# Altium project ESP01-S-UART.PrjPcb
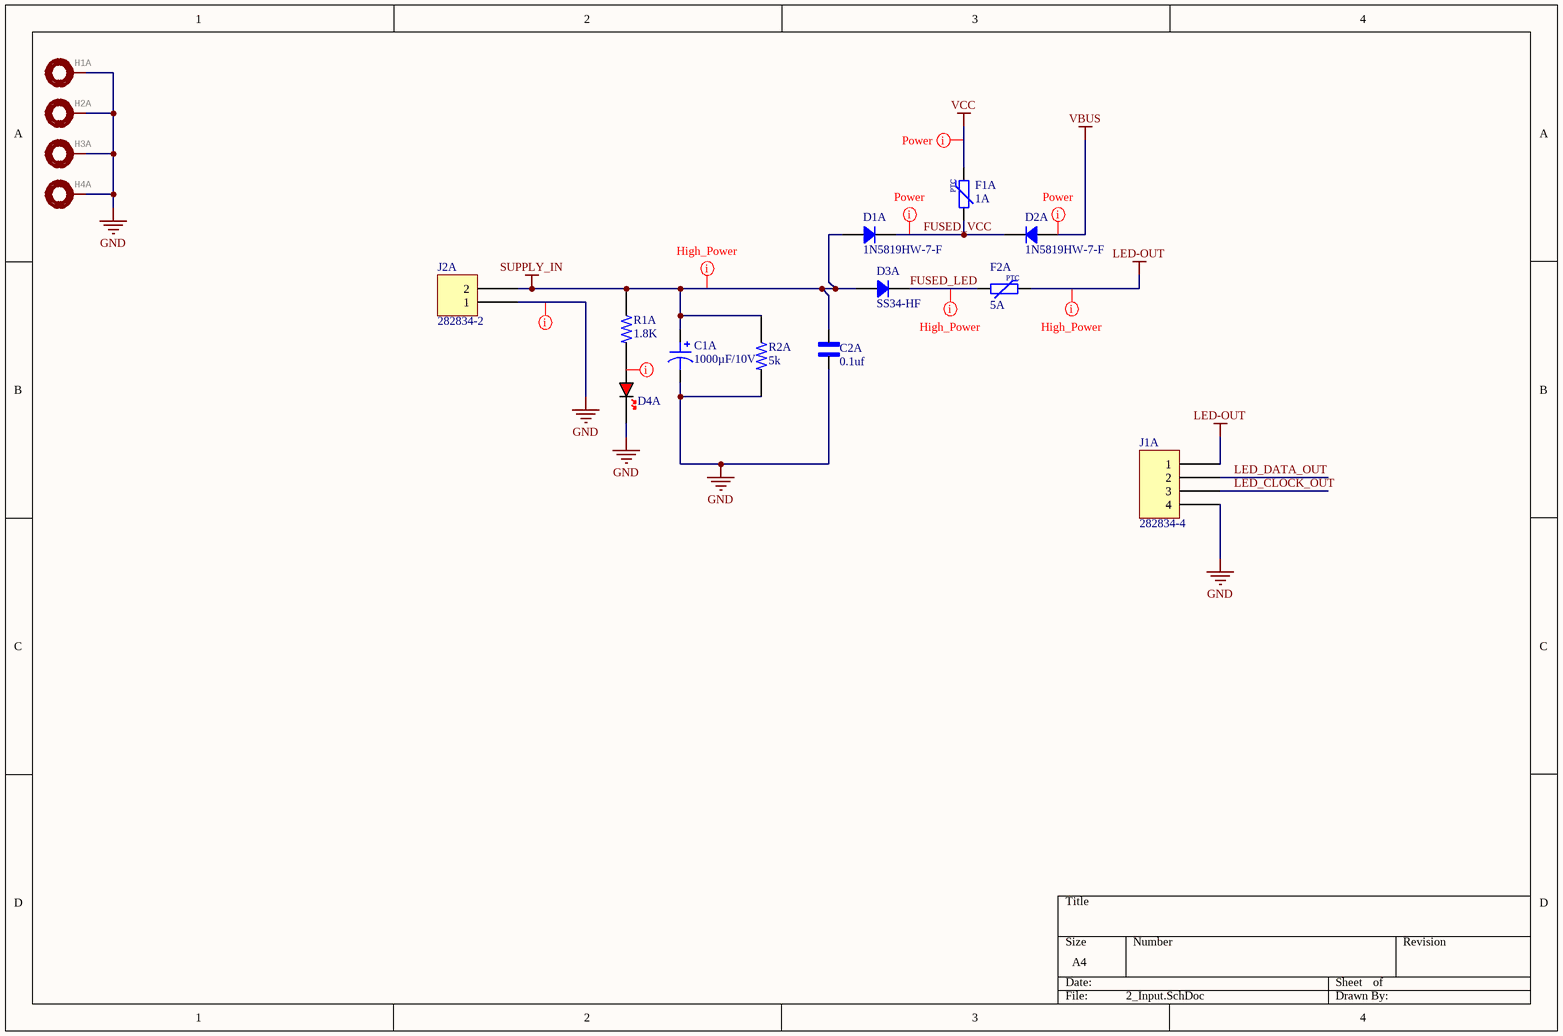
[diagram p0: 2_Input.SchDoc]
5 sheets, 62 parts. Net scope: global (net labels, ports and power ports of the same name join across sheets).
Board file: ESP01-S-UART_Version_1.PcbDoc
Sheets:
  1_Overview.SchDoc
  2_Input.SchDoc
  3_LDO.SchDoc
  4_USB.SchDoc
  5_ESP_01.SchDoc

## Sheet 1_Overview.SchDoc
size A4; SheetNumber: 5; SheetTotal: 5

## Sheet 2_Input.SchDoc
size A4; SheetNumber: 2; SheetTotal: 5

### Parts
C1A  1000µF/10V  [CAP TH ALUM ELEC D8.00mm S3.50mm H13.00mm]
C2A  0.1uf  [C-0603]
D1A  1N5819HW-7-F  [SOD-123]
D2A  1N5819HW-7-F  [SOD-123]
D3A  SS34-HF  [DO214AC SMA]
D4A  RED  [LED_0603_RED]  (value not drawn)
F1A  1A  [FUSE_1206]
F2A  5A  [FUSE_1206]
H1A  MOUNTING PAD, round  [2,8-PAD]  (value not drawn)
H2A  MOUNTING PAD, round  [2,8-PAD]  (value not drawn)
H3A  MOUNTING PAD, round  [2,8-PAD]  (value not drawn)
H4A  MOUNTING PAD, round  [2,8-PAD]  (value not drawn)
J1A  282834-4  [TE 282834-4]
J2A  282834-2  [TE 282834-2]
R1A  1.8K  [R-0603]
R2A  5k  [R-0603]

### Nets
GND: C1A.2 C2A.1 D4A.K H1A.1(MOUNT) H2A.1(MOUNT) H3A.1(MOUNT) H4A.1(MOUNT) J1A.4 J2A.1 R2A.2
LED-OUT: F2A.2 J1A.1
SUPPLY_IN: C1A.1 C2A.2 D1A.1 D3A.1 J2A.2 R1A.1 R2A.1
VBUS: D2A.1
VCC: F1A.2
FUSED_LED: D3A.2 F2A.1
FUSED_VCC: D1A.2 D2A.2 F1A.1
LED_CLOCK_OUT: J1A.3
LED_DATA_OUT: J1A.2
NetD4A_A: D4A.A R1A.2

### Layout directives
net class Power; rule Supply Nets [Voltage = 0.000]: FUSED_VCC, VBUS, VCC
net class Signal: NetD4A_A
net class GND; rule Supply Nets [Voltage = 0.000]: GND
net class High_Power; rule Supply Nets [Voltage = 0.000]: FUSED_LED, LED-OUT, SUPPLY_IN

### Notes on the sheet
- (in symbol FUSE_PPTC_1206) PTC

### Library data of the parts
C1A = 10PK1000MEFC8X11.5: CAP ALUM 1000UF 20% 10V RADIAL; manufacturer: Rubycon; Capacitance: 1000µF; Lifetime @ Temp.: 2000 Hrs @ 85°C; Polarization: Polar; Ripple Current @ High Frequency: 792mA @ 10kHz; Ripple Current @ Low Frequency: 660mA @ 120Hz; Part Number: 10PK1000MEFC8X11.5; Applications: General Purpose; componentlink1description: Datasheet; componentlink1url: http://www.rubycon.co.jp/en/catalog/e_pdfs/aluminum/e_pk.pdf; componentlink2description: DigiKey Link; componentlink2url: http://digikey.com/product-detail/en/rubycon/10PK1000MEFC8X11.5/1189-1050-ND/3133980; Device Package: Radial, Can; Height - Seated (Max): 0.512" (13.00mm); lastupdated: 07-09-2020 05:24:54 AM; Lead Spacing: 0.138" (3.50mm); Lifecycle Status: Active; Minimum Order: 1; Mounting Type: Through Hole; Operating Temperature: -40°C ~ 85°C; Package / Case: Radial, Can; packaging: Bulk; partid: 23938; Part Status: Active; price: 0.34; series: PK; Size / Dimension: 0.315" Dia (8.00mm); Supplier 1: DigiKey; Supplier Part Number 1: 1189-1050-ND; Tolerance: ±20%; value: 1000µF/10V; Voltage - Rated: 10V
C2A = C-0603: Ceramic Capacitor 16V 0603 (1608 Metric); MP: C0603C104J4RAC; MF: KEMET; SnapEDA_Link: https://www.snapeda.com/parts/C0603C104J4RAC/KEMET/view-part/1763758/?ref=snap; Availability: Warning; Package: 0603 KEMET; Check_prices: https://www.snapeda.com/parts/C0603C104J4RAC/KEMET/view-part/1763758/?ref=eda; Value: *; Price: None
D1A D2A = 1N5819HW-7-F: DIODE SCHOTTKY 40V 1A SOD123; Manufacturer: Diodes Incorporated; Capacitance @ Vr, F: 60pF @ 4V, 1MHz; Current - Reverse Leakage @ Vr: 1mA @ 40V; Speed: Fast Recovery =< 500ns, > 200mA (Io); Voltage - Forward (Vf) (Max) @ If: 450mV @ 1A; Part Number: 1N5819HW-7-F; ComponentLink1Description: Datasheet; ComponentLink1URL: https://www.diodes.com/assets/Datasheets/ds30217.pdf; ComponentLink2Description: DigiKey Link; ComponentLink2URL: http://digikey.com/product-detail/en/diodes-incorporated/1N5819HW-7-F/1N5819HW-FDICT-ND/815283; Current - Average Rectified (Io): 1A; Diode Type: Schottky; LastUpdated: 19-09-2022 13:46:25; Lifecycle Status: Active; Minimum Order: 1; Mounting Type: Surface Mount; Operating Temperature - Junction: -65°C ~ 125°C; Package / Case: SOD-123; Packaging: TapeAndReel; PartId: 2212; Part Status: Active; Price: 0.08; Series: -; Supplier 1: DigiKey; Supplier Part Number 1: 1N5819HW-FDICT-ND; Supplier Device Package: SOD-123; Voltage - DC Reverse (Vr) (Max): 40V
D3A = SS34-HF: DIODE SCHOTTKY 40V 3A DO214AC SM; Manufacturer: Comchip Technology; Capacitance @ Vr, F: 450pF @ 4V, 1MHz; Current - Reverse Leakage @ Vr: 500 µA @ 40 V; Speed: Fast Recovery =< 500ns, > 200mA (Io); Voltage - Forward (Vf) (Max) @ If: 550 mV @ 3 A; Part Number: SS34-HF; ComponentLink1Description: Datasheet; ComponentLink1URL: http://www.comchiptech.com/admin/files/product/20190514101641.pdf; ComponentLink2Description: DigiKey Link; ComponentLink2URL: https://www.digikey.com/en/products/detail/comchip-technology/SS34-HF/10279693; Current - Average Rectified (Io): 3A; Diode Type: Schottky; LastUpdated: 19-09-2022 01:46:08 PM; Lifecycle Status: Active; Minimum Order: 1; Mounting Type: Surface Mount; Operating Temperature - Junction: -55°C ~ 125°C; Package / Case: DO-214AC, SMA; Packaging: TapeAndReel; PartId: 2138; Part Status: Active; Price: 0.07; Series: -; Supplier 1: DigiKey; Supplier Part Number 1: 641-2115-1-ND; Supplier Device Package: DO-214AC (SMA); Voltage - DC Reverse (Vr) (Max): 40 V
D4A = LED_0603_RED: LED 0603 RED SMD
F1A F2A = FUSE_PPTC_1206: Fuse PPTC SMD 1206; Manufacturer: *; Manufacturer Part Number: *
H1A H2A H3A H4A = MOUNT-PAD-ROUND2.8: GateName_1: G$1; DeviceName: 2.8; POPULARITY: 6; SymbolName_1: MOUNT-PAD; LibraryName: Holes-Custom; DeviceSetName: MOUNT-PAD-ROUND; Package: 2,8-PAD
J1A = 282834-4: TERM BLK 4P SIDE ENT 2.54MM PCB; Manufacturer: TE Connectivity AMP Connectors; Pitch: 0.100" (2.54mm); Current: 10A; Mating Orientation: Horizontal with Board; Number of Levels: 1; Positions Per Level: 4; Voltage: 150V; Wire Gauge: 16-30 AWG; Wire Termination: Screw - Rising Cage Clamp; Packaging: Bulk; Part Number: 282834-4; Color: Green; ComponentLink1Description: Datasheet; ComponentLink1URL: https://www.te.com/commerce/DocumentDelivery/DDEController?Action=srchrtrv&DocNm=282834&DocType=Customer+Drawing&DocLang=English; ComponentLink2Description: DigiKey Link; ComponentLink2URL: http://digikey.com/product-detail/en/te-connectivity-amp-connectors/282834-4/A98335-ND/1153265; LastUpdated: 15-01-2020 04:16:05 AM; Lifecycle Status: Active; Minimum Order: 1; Mounting Type: Through Hole; Part Status: Active; Price: 2.68; Series: Buchanan; Supplier 1: DigiKey; Supplier Part Number 1: A98335-ND
J2A = 282834-2: TERM BLK 2P SIDE ENT 2.54MM PCB; Manufacturer: TE Connectivity AMP Connectors; Pitch: 0.100" (2.54mm); Current: 10A; Mating Orientation: Horizontal with Board; Number of Levels: 1; Positions Per Level: 2; Voltage: 150V; Wire Gauge: 16-30 AWG; Wire Termination: Screw - Rising Cage Clamp; Packaging: Bulk; Part Number: 282834-2; Color: Green; ComponentLink1Description: Datasheet; ComponentLink1URL: https://www.te.com/commerce/DocumentDelivery/DDEController?Action=srchrtrv&DocNm=282834&DocType=Customer+Drawing&DocLang=English; ComponentLink2Description: DigiKey Link; ComponentLink2URL: http://digikey.com/product-detail/en/te-connectivity-amp-connectors/282834-2/A98333-ND/1150135; LastUpdated: 15-01-2020 04:15:38 AM; Lifecycle Status: Active; Minimum Order: 1; Mounting Type: Through Hole; Part Status: Active; Price: 0.88; Series: Buchanan; Supplier 1: DigiKey; Supplier Part Number 1: A98333-ND
R1A R2A = R-0603: 0603; MP: 2-1623703-0; Power_Rating: .1 W; Value: 10K; Tolerance: 1%; MF: TE Connectivity; Package: 0603; Price: None; Resistance: 10K; Check_prices: https://www.snapeda.com/parts/2-1623703-0/TE%20Connectivity/view-part/2213192/?ref=eda; SnapEDA_Link: https://www.snapeda.com/parts/2-1623703-0/TE%20Connectivity/view-part/2213192/?ref=snap; Availability: Warning

## Sheet 3_LDO.SchDoc
size A4; SheetNumber: 3; SheetTotal: 5
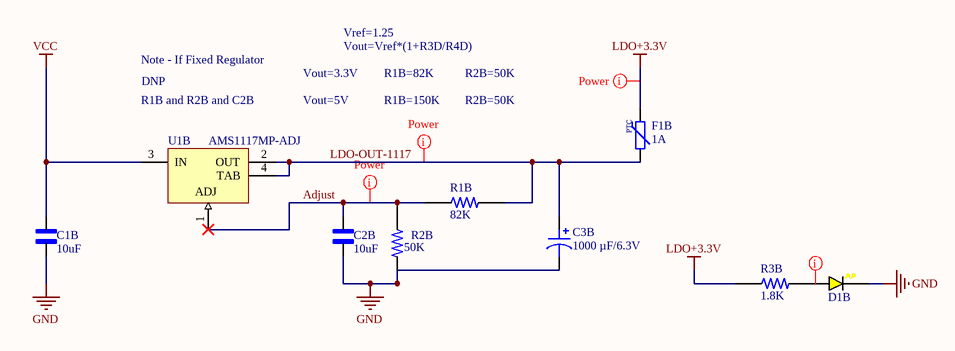
[diagram p1: 3_LDO.SchDoc]

### Parts
C1B  10uF  [C-0603]
C2B  10uF  [C-0603]
C3B  1000 µF/6.3V  [CAP AL TH D8 L3.5 H12.5]
D1B  YELLOW  [LED_0402_YELLOW]  (value not drawn)
F1B  1A  [FUSE_1206]
R1B  82K  [R-0603]
R2B  50K  [R-0603]
R3B  1.8K  [R-0603]
U1B  AMS1117MP-ADJ  [MP04A_N]

### Nets
GND: C1B.1 C2B.1 C3B.2 D1B.K R2B.2
LDO+3.3V: F1B.2 R3B.1
VCC: C1B.2 U1B.3(IN)
Adjust: C2B.2 R1B.1 R2B.1 U1B.1(ADJ)
LDO-OUT-1117: C3B.1 F1B.1 R1B.2 U1B.2(OUT) U1B.4(TAB)
NetD1B_A: D1B.A R3B.2

### Layout directives
net class Power; rule Supply Nets [Voltage = 0.000]: Adjust, LDO+3.3V, LDO-OUT-1117
net class Signal: NetD1B_A

### Notes on the sheet
- Vout=Vref*(1+R3D/R4D)
- Vref=1.25
- Note - If Fixed Regulator
- R1B and R2B and C2B
- DNP
- Vout=3.3V
- Vout=5V
- R1B=82K
- R1B=150K
- R2B=50K
- (in symbol FUSE_PPTC_1206) PTC

### Library data of the parts
C1B C2B = C-0603: as C2A on sheet 2_Input; SnapEDA_Link: https://www.snapeda.com/parts/C0603C104J4RAC/KEMET/view-part/1763758/?ref=snap; Availability: Warning; Package: 0603 KEMET; Check_prices: https://www.snapeda.com/parts/C0603C104J4RAC/KEMET/view-part/1763758/?ref=eda; Value: *; Price: None
C3B = ECA-0JHG102: CAP ALUM 1000UF 20% 6.3V RADIAL; manufacturer: Panasonic Electronic Components; Capacitance: 1000 µF; Lifetime @ Temp.: 1000 Hrs @ 105°C; Polarization: Polar; Ripple Current @ High Frequency: 437 mA @ 100 kHz; Ripple Current @ Low Frequency: 380 mA @ 120 Hz; Part Number: ECA-0JHG102; Applications: General Purpose; componentlink1description: Datasheet; componentlink1url: https://industrial.panasonic.com/cdbs/www-data/pdf/RDF0000/ABA0000C75.pdf; componentlink2description: DigiKey Link; componentlink2url: https://www.digikey.com/en/products/detail/panasonic-electronic-components/ECA-0JHG102/245108; Device Package: Radial, Can; Height - Seated (Max): 0.492" (12.50mm); lastupdated: 27-12-2022 10:20:14 PM; Lead Spacing: 0.138" (3.50mm); Lifecycle Status: Active; Minimum Order: 1; Mounting Type: Through Hole; Operating Temperature: -55°C ~ 105°C; Package / Case: Radial, Can; packaging: Bulk; partid: 7190; Part Status: Active; price: 0.15; series: NHG-A; Size / Dimension: 0.315" Dia (8.00mm); Supplier 1: DigiKey; Supplier Part Number 1: P5509-ND; Tolerance: ±20%; value: 1000 µF/6.3V; Voltage - Rated: 6.3 V
D1B = LED_0402_YELLOW: LED 0402 YELLOW SMD
F1B = FUSE_PPTC_1206: Fuse PPTC SMD 1206; Manufacturer: *; Manufacturer Part Number: *
R1B R2B R3B = R-0603: as R1A on sheet 2_Input; Package: 0603; Price: None; Resistance: 10K; Check_prices: https://www.snapeda.com/parts/2-1623703-0/TE%20Connectivity/view-part/2213192/?ref=eda; SnapEDA_Link: https://www.snapeda.com/parts/2-1623703-0/TE%20Connectivity/view-part/2213192/?ref=snap; Availability: Warning
U1B = CMP-0062-01645-3: 800mA Low-Dropout Linear Regulator, 4-pin SOT-223; PartNumber: LM1117MP-ADJ; Manufacturer: National Semiconductor; High-Reliability: Y; PackageTopMarking: XYTT*N03A; CompType: LDO IC; PowerWise: N; ComponentLink2URL: http://www.national.com/ds/LM/LM1117.pdf; ComponentLink1Description: Manufacturer URL; DatasheetVersion: Apr-2006; PackageReference: MP04A; RoHS: N; ComponentLink3Description: LM1117 Web Page; RevisionNote: SCH symbol layout adjusted; PackageDescription: Molded SOT-223, 6.50 x 3.56 x 1.6mm Body, 4 Lead, 2.3mm Pitch; Code_IPC: SOT223-4; ComponentLink1URL: http://www.national.com/; ComponentLink4Description: MP04A Package Page; ComponentLink3URL: http://www.national.com/pf/LM/LM1117.html; PackageVersion: revB, Apr-2003; ComponentLink2Description: LM1117 Datasheet; PinCount: 4; ComponentLink4URL: http://www.national.com/packaging/folders/mp04a.html; Code_JEDEC: TO-261-AA

## Sheet 4_USB.SchDoc
size A4; SheetNumber: 4; SheetTotal: 5
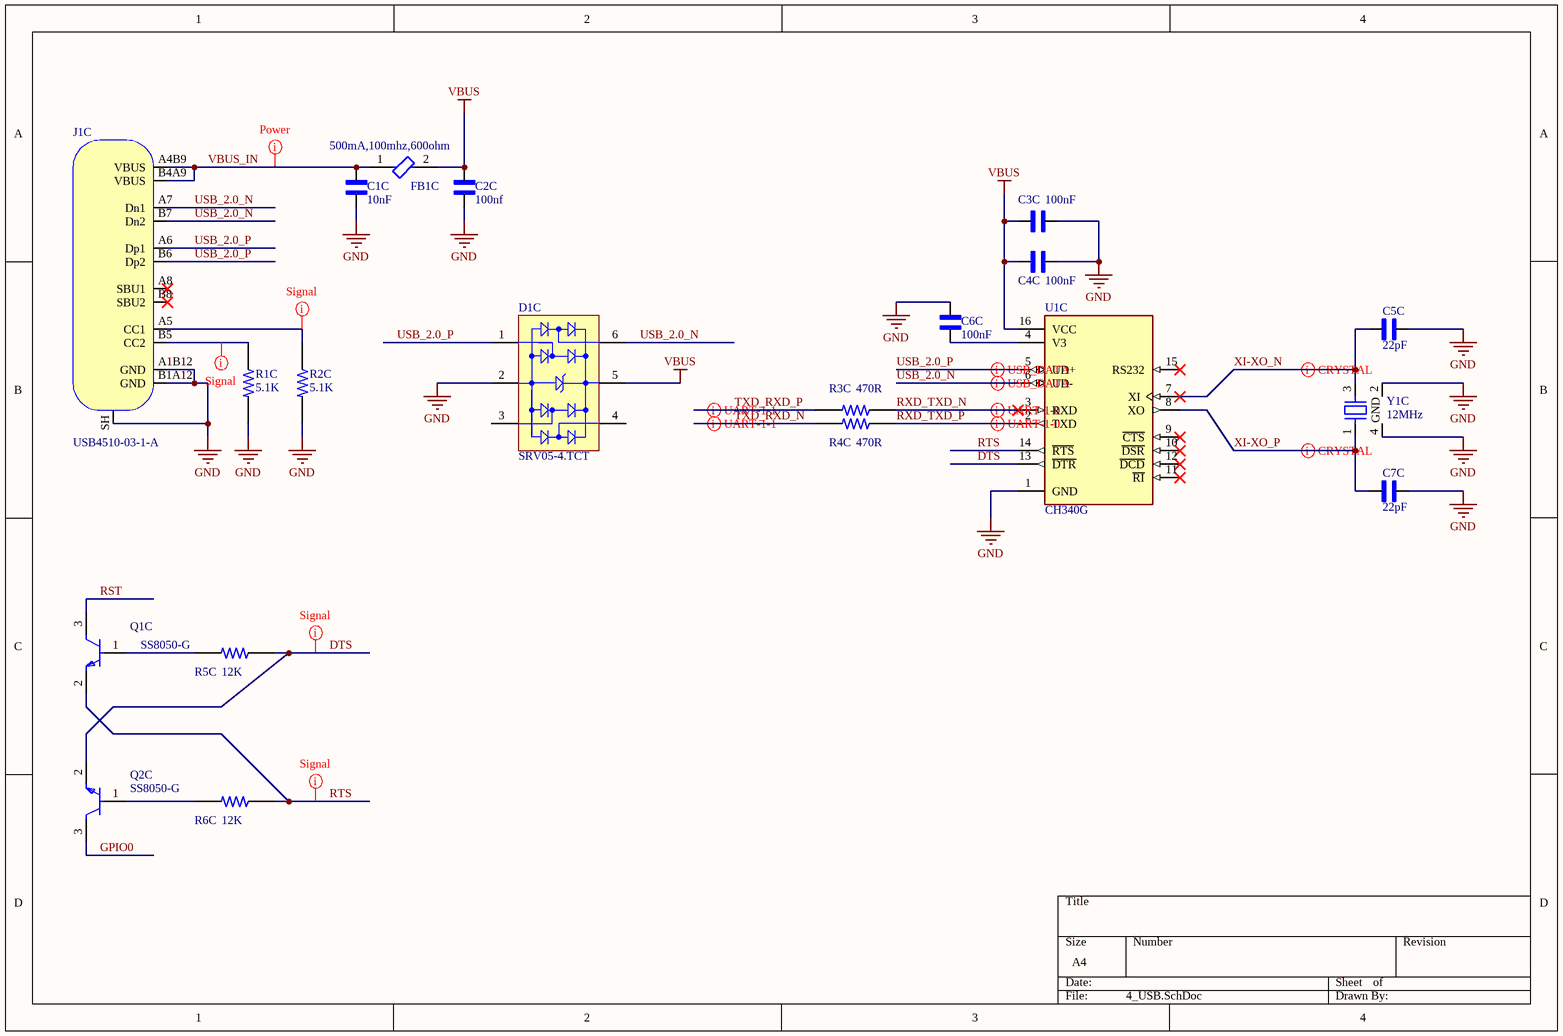
[diagram p2: 4_USB.SchDoc]

### Parts
C1C  10nF  [C-0603]
C2C  100nf  [C-0603]
C3C  100nF  [C-0603]
C4C  100nF  [C-0603]
C5C  22pF  [C-0603]
C6C  100nF  [C-0603]
C7C  22pF  [C-0603]
D1C  SRV05-4.TCT  [SMTC-SOT23-6_V]
FB1C  500mA,100mhz,600ohm  [FP-BLM21-0_2-t0_85-e0_5-IPC_A]
J1C  USB4510-03-1-A  [USB4510-03-1-A]
Q1C  SS8050-G  [FP-SS8050-G-MFG]
Q2C  SS8050-G  [FP-SS8050-G-MFG]
R1C  5.1K  [R-0603]
R2C  5.1K  [R-0603]
R3C  470R  [R-0603]
R4C  470R  [R-0603]
R5C  12K  [R-0603]
R6C  12K  [R-0603]
U1C  CH340G  [SOIC127P600X180-16N]
Y1C  12MHz  [ABRACON ABM10]

### Nets
GND: C1C.1 C2C.1 C3C.1 C4C.1 C5C.2 C6C.1 C7C.2 D1C.2(GND) J1C.A1B12(GND) J1C.B1A12(GND) J1C.SH(SHIELD) R1C.2 R2C.2 U1C.1(GND) Y1C.2(GND) Y1C.4(GND)
VBUS: C2C.2 C3C.2 C4C.2 D1C.5(VBUS) FB1C.2 U1C.16(VCC)
DTS: Q2C.2(E) R5C.1 U1C.13(~{DTR})
GPIO0: Q2C.3(C)
RST: Q1C.3(C)
RTS: Q1C.2(E) R6C.1 U1C.14(~{RTS})
RXD_TXD_N: R3C.1 U1C.3(RXD)
RXD_TXD_P: R4C.1 U1C.2(TXD)
TXD_RXD_N: R4C.2
TXD_RXD_P: R3C.2
USB_2.0_N: D1C.6(I/O_4) J1C.A7(Dn1) J1C.B7(Dn2) U1C.6(UD-)
USB_2.0_P: D1C.1(I/O_1) J1C.A6(Dp1) J1C.B6(Dp2) U1C.5(UD+)
VBUS_IN: C1C.2 FB1C.1 J1C.A4B9(VBUS) J1C.B4A9(VBUS)
XI-XO_N: C5C.1 U1C.7(XI) Y1C.3
XI-XO_P: C7C.1 U1C.8(XO) Y1C.1
NetC6C_2: C6C.2 U1C.4(V3)
NetJ1C_A5: J1C.A5(CC1) R2C.1
NetJ1C_B5: J1C.B5(CC2) R1C.1
NetQ1C_1: Q1C.1(B) R5C.2
NetQ2C_1: Q2C.1(B) R6C.2

Not connected (* = marked no-connect by the designer): D1C 3(I/O_2) 4(I/O_3); J1C A8(SBU1)* B8(SBU2)*; U1C 9(~{CTS})* 10(~{DSR})* 11(~{RI})* 12(~{DCD})* 15(RS232)*

### Layout directives
differential pair; differential pair class DIFF_PAIR; net class CRYSTAL: XI-XO_N, XI-XO_P
differential pair; differential pair class DIFF_PAIR; net class UART: RXD_TXD_N, RXD_TXD_P, TXD_RXD_N, TXD_RXD_P
differential pair; differential pair class DIFF_PAIR; net class USB_DATA: USB_2.0_N, USB_2.0_P
net class Power; rule Supply Nets [Voltage = 0.000]: VBUS_IN
net class Signal: DTS, NetJ1C_A5, NetJ1C_B5, RTS

### Library data of the parts
C1C C2C C3C C4C C5C C6C C7C = C-0603: as C2A on sheet 2_Input; SnapEDA_Link: https://www.snapeda.com/parts/C0603C104J4RAC/KEMET/view-part/1763758/?ref=snap; Availability: Warning; Package: 0603 KEMET; Check_prices: https://www.snapeda.com/parts/C0603C104J4RAC/KEMET/view-part/1763758/?ref=eda; Value: *; Price: None
D1C = CMP-2000-05358-1: RailClamp(R) Low Capacitance TVS Diode Array, 5 pF, 17.5 VC, -55 to 125 degC, 6-Pin SOT23, RoHS, Tape and Reel; Manufacturer: Semtech; Leakage Current (Max): 5uA; Polarity: Uni-Directional; Peak Pulse Power Dissipation: 300W; Clamping Voltage: 17.5V; Number of Elements: 1; Working Voltage: 5V; Test Current (It): 1mA; Configuration: Quad; Reverse Breakdown Voltage: 6V; Suppressor Type: DiodeArrays; Peak Pulse Current: 12A; Product Depth (mm): 1.6mm; Product Height (mm): 1.15mm; Clamping Voltage (Max): 12.5V; Rad Hardened: No; Product Length (mm): 2.9mm; Capacitance Value: 5pF; Mounting: SurfaceMount; Datasheet URL: https://datasheet.ciiva.com/8029/srv05-4-8029973.pdf; Datasheet Version: Jan-08; Packaging: TapeandReel; Package / Case: SOT-23; Operating Temp Range: -55Cto125C; Pin Count: 6; Direction Type: Uni-Directional; Operating Temperature Min Deg. C: -55C; Reverse Stand-off Voltage: 5V; Leakage Current: 5uA; Manufacturer URL: http://www.semtech.com/; Working Voltage (Max): 5V; Package Reference: SOT23-6; Package Description: 6-Pin Small Outline Transistor, Body 2.9 x 1.6 mm, Pitch 0.95 mm; Operating Temperature Max Deg. C: 125C; Operating Temperature Classification: Military; Mounting Style: SurfaceMount
FB1C = CMP-0686-00646-3: BLM21BB121SN1D; Shielding: Unshielded; Number of Circuits: 1; DC Resistance-Max: 250mR; Material: Ferrite; Tolerance: 25%; DC Resistance (DCR): 190mR; Max Current Rating: 600mA; Impedance: 120R; Max DC Current: 200mA; Case Code (Imperial): 0805; RoHS Compliant: Yes; Frequency: 100MHz; Lead Free: Lead Free; Max Operating Temperature: 125°C; Min Operating Temperature: -55°C; Length: 2mm; Packaging: Tape and Reel; Case Code (Metric): 2012; Package Quantity: 1; Depth: 1.45mm; Test Frequency: 100MHz; Width: 1.25mm; Contact Plating: Tin; Height: 0.85mm; Number of Pins: 2; Case/Package: 0805; Termination: SMD/SMT; REACH SVHC: No SVHC; Current Rating: 600mA; Weight: 0.000194oz; Core Material: Ferrite; Series: BLM21B; Number of Lines: 1
J1C = USB4510-03-1-A: USB Connector Type C SMT Mid-Mount 16 Pin; Manufacturer: GCT; Manufacturer Part Number: USB4510-03-1-A
Q1C Q2C = CMP-20235-000001-1: NPN TRANSISTOR 1.5A 40V SOT-23 R; Transition Frequency: 100MHz; Max Breakdown Voltage: 25V; Collector Emitter Voltage (VCEO): 400mV; Max Power Dissipation: 300mW; Max Collector Current: 1.5A; Case/Package: TO-236-3; Packaging: Tape and Reel; RoHS Compliant: Yes; Mount: Surface Mount; Collector Emitter Breakdown Voltage: 25V
R1C R2C R3C R4C R5C R6C = R-0603: as R1A on sheet 2_Input; Package: 0603; Price: None; Resistance: 10K; Check_prices: https://www.snapeda.com/parts/2-1623703-0/TE%20Connectivity/view-part/2213192/?ref=eda; SnapEDA_Link: https://www.snapeda.com/parts/2-1623703-0/TE%20Connectivity/view-part/2213192/?ref=snap; Availability: Warning
Y1C = ABM10-167-12.000MHZ-T3: CRYSTAL 12.00MHZ 8PF LOW ESR SMD; Manufacturer: Abracon LLC; ESR (Equivalent Series Resistance): 125 Ohms; Frequency Stability: ±30ppm; Frequency Tolerance: ±10ppm; Operating Mode: Fundamental; Part Number: ABM10-167-12.000MHZ-T3; ComponentLink1Description: Datasheet; ComponentLink1URL: https://abracon.com/Resonators/ABM10-167-12.000MHz.pdf; ComponentLink2Description: DigiKey Link; ComponentLink2URL: http://digikey.com/product-detail/en/abracon-llc/ABM10-167-12.000MHZ-T3/535-13521-1-ND/6140274; Device Package: 4-SMD, No Lead; Frequency: 12MHz; Height - Seated (Max): 0.028" (0.70mm); LastUpdated: 19-03-2020 10:27:46 PM; Lifecycle Status: Active; Load Capacitance: 8pF; Minimum Order: 1; Mounting Type: Surface Mount; Operating Temperature: -40°C ~ 85°C; Package / Case: 4-SMD, No Lead; Packaging: TapeAndReel; PartId: 284; Part Status: Active; Price: 0.28; Series: ABM10; Size / Dimension: 0.098" L x 0.079" W (2.50mm x 2.00mm); Supplier 1: DigiKey; Supplier Part Number 1: 535-13521-1-ND; Type: MHz Crystal; Value: 12MHz
U1C = CH340G: Value: *; MP: CH340G; Package: None; Availability: Unavailable; Price: None

## Sheet 5_ESP_01.SchDoc
size A4; SheetNumber: 5; SheetTotal: 5
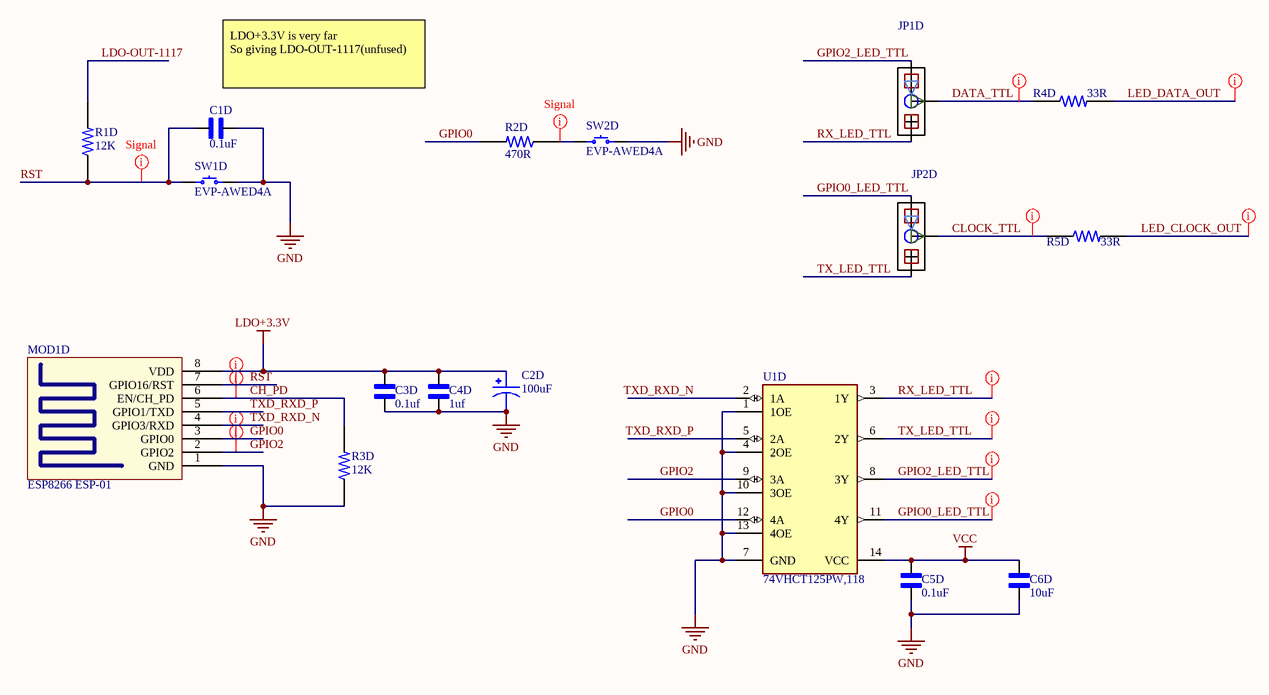
[diagram p3: 5_ESP_01.SchDoc]

### Parts
C1D  0.1uF  [C-0603]
C2D  100uF  [1411-3528]
C3D  0.1uf  [C-0603]
C4D  1uf  [C-0603]
C5D  0.1uF  [C-0603]
C6D  10uF  [C-0603]
JP1D  Solder Pad  [Solder_Pad_3_Pin_NC_Medium]  (value not drawn)
JP2D  Solder Pad  [Solder_Pad_3_Pin_NC_Medium]  (value not drawn)
MOD1D  ESP8266 ESP-01  [ESP8266 ESP-01]
R1D  12K  [R-0603]
R2D  470R  [R-0603]
R3D  12K  [R-0603]
R4D  33R  [R-0603]
R5D  33R  [R-0603]
SW1D  EVP-AWED4A  [PANASONIC EVPAW]
SW2D  EVP-AWED4A  [PANASONIC EVPAW]
U1D  74VHCT125PW,118  [SOP65P640X110-14N]

### Nets
GND: C1D.2 C2D.2 C3D.1 C4D.1 C5D.1 C6D.1 MOD1D.1(GND) R3D.1 SW1D.2 SW2D.2 U1D.1(1OE) U1D.4(2OE) U1D.7(GND) U1D.10(3OE) U1D.13(4OE)
LDO+3.3V: C2D.1 C3D.2 C4D.2 MOD1D.8(VDD)
VCC: C5D.2 C6D.2 U1D.14(VCC)
CH_PD: MOD1D.6(EN/CH_PD) R3D.2
CLOCK_TTL: JP2D.2 R5D.1
DATA_TTL: JP1D.2 R4D.1
GPIO0: MOD1D.3(GPIO0) R2D.2 U1D.12(4A)
GPIO0_LED_TTL: JP2D.1 U1D.11(4Y)
GPIO2: MOD1D.2(GPIO2) U1D.9(3A)
GPIO2_LED_TTL: JP1D.1 U1D.8(3Y)
LDO-OUT-1117: R1D.2
LED_CLOCK_OUT: R5D.2
LED_DATA_OUT: R4D.2
RST: C1D.1 MOD1D.7(GPIO16/RST) R1D.1 SW1D.1
RX_LED_TTL: JP1D.3 U1D.3(1Y)
TX_LED_TTL: JP2D.3 U1D.6(2Y)
TXD_RXD_N: MOD1D.4(GPIO3/RXD) U1D.2(1A)
TXD_RXD_P: MOD1D.5(GPIO1/TXD) U1D.5(2A)
NetR2D_1: R2D.1 SW2D.1

### Layout directives
net class Signal: CH_PD, CLOCK_TTL, DATA_TTL, GPIO0, GPIO0_LED_TTL, GPIO2, GPIO2_LED_TTL, LED_CLOCK_OUT, LED_DATA_OUT, NetR2D_1, RST, RX_LED_TTL, TX_LED_TTL

### Notes on the sheet
- (near C1D) LDO+3.3V is very far
  So giving LDO-OUT-1117(unfused)

### Library data of the parts
C1D C3D C4D C5D C6D = C-0603: as C2A on sheet 2_Input; SnapEDA_Link: https://www.snapeda.com/parts/C0603C104J4RAC/KEMET/view-part/1763758/?ref=snap; Availability: Warning; Package: 0603 KEMET; Check_prices: https://www.snapeda.com/parts/C0603C104J4RAC/KEMET/view-part/1763758/?ref=eda; Value: *; Price: None
C2D = C-1411 (3528 Metric): Molded Tantalum Capacitors 16V 1411 (3528 Metric); MF: KEMET; MP: T495B106K025ATE750; Package: 1411 KEMET; Value: *; Availability: Unavailable; SnapEDA_Link: https://www.snapeda.com/parts/T495B106K025ATE750/KEMET/view-part/1680496/?ref=snap; Price: None
JP1D JP2D = Solder_Pad_3_Pin_NC_Medium: Solder Pad 3 Pin NC 1.016 mm Pitch
R1D R2D R3D R4D R5D = R-0603: as R1A on sheet 2_Input; Package: 0603; Price: None; Resistance: 10K; Check_prices: https://www.snapeda.com/parts/2-1623703-0/TE%20Connectivity/view-part/2213192/?ref=eda; SnapEDA_Link: https://www.snapeda.com/parts/2-1623703-0/TE%20Connectivity/view-part/2213192/?ref=snap; Availability: Warning
SW1D SW2D = EVP-AWED4A: 3.0MM X 2.0MM / 3.3N / 0.15MM ST; Manufacturer: Panasonic Electronic Components; Actuator Height off PCB, Vertical: 0.60mm; Actuator Orientation: Top Actuated; Actuator Type: Standard; Circuit: SPST-NO; Contact Rating @ Voltage: 0.02A @ 15VDC; Illumination: Non-Illuminated; Ingress Protection: IP67 - Dust Tight, Waterproof; Operating Force: 330gf; Outline: 3.00mm x 2.00mm; Switch Function: Off-Mom; Part Number: EVP-AWED4A; ComponentLink1Description: Datasheet; ComponentLink1URL: https://industrial.panasonic.com/ac/cdn/e/control/switch/light-touch/catalog/sw_lt_eng_3020s.pdf; ComponentLink2Description: DigiKey Link; ComponentLink2URL: https://www.digikey.com/en/products/detail/panasonic-electronic-components/EVP-AWED4A/8568275; LastUpdated: 29-12-2022 09:10:40 PM; Lifecycle Status: Active; Minimum Order: 1; Mounting Type: Surface Mount; Operating Temperature: -40°C ~ 85°C; Packaging: TapeAndReel; Part Status: Active; Price: 0.16; Series: EVPAW; Supplier 1: DigiKey; Supplier Part Number 1: P123440CT-ND; Termination Style: SMD (SMT) Tab
U1D = 74VHCT125PW,118: Buffer, Non-Inverting 4 Element 1 Bit per Element 3-State Output 14-SOIC; MP: 74HC125; MF: Nexperia USA; Value: *; SnapEDA_Link: https://www.snapeda.com/parts/74HC125/Nexperia%20USA%20Inc./view-part/560724/?ref=snap; Availability: Unavailable; Price: None; Package: SOIC-14 STMicroelectronics

## Nets that join several sheets
GND: 2_Input (10 pins), 3_LDO (5 pins), 4_USB (16 pins), 5_ESP_01 (15 pins)
LDO+3.3V: 3_LDO (F1B.2 R3B.1), 5_ESP_01 (C2D.1 C3D.2 C4D.2 MOD1D.8)
VBUS: 2_Input (D2A.1), 4_USB (6 pins)
VCC: 2_Input (F1A.2), 3_LDO (C1B.2 U1B.3), 5_ESP_01 (C5D.2 C6D.2 U1D.14)
GPIO0: 4_USB (Q2C.3), 5_ESP_01 (MOD1D.3 R2D.2 U1D.12)
LDO-OUT-1117: 3_LDO (5 pins), 5_ESP_01 (R1D.2)
LED_CLOCK_OUT: 2_Input (J1A.3), 5_ESP_01 (R5D.2)
LED_DATA_OUT: 2_Input (J1A.2), 5_ESP_01 (R4D.2)
RST: 4_USB (Q1C.3), 5_ESP_01 (C1D.1 MOD1D.7 R1D.1 SW1D.1)
TXD_RXD_N: 4_USB (R4C.2), 5_ESP_01 (MOD1D.4 U1D.2)
TXD_RXD_P: 4_USB (R3C.2), 5_ESP_01 (MOD1D.5 U1D.5)